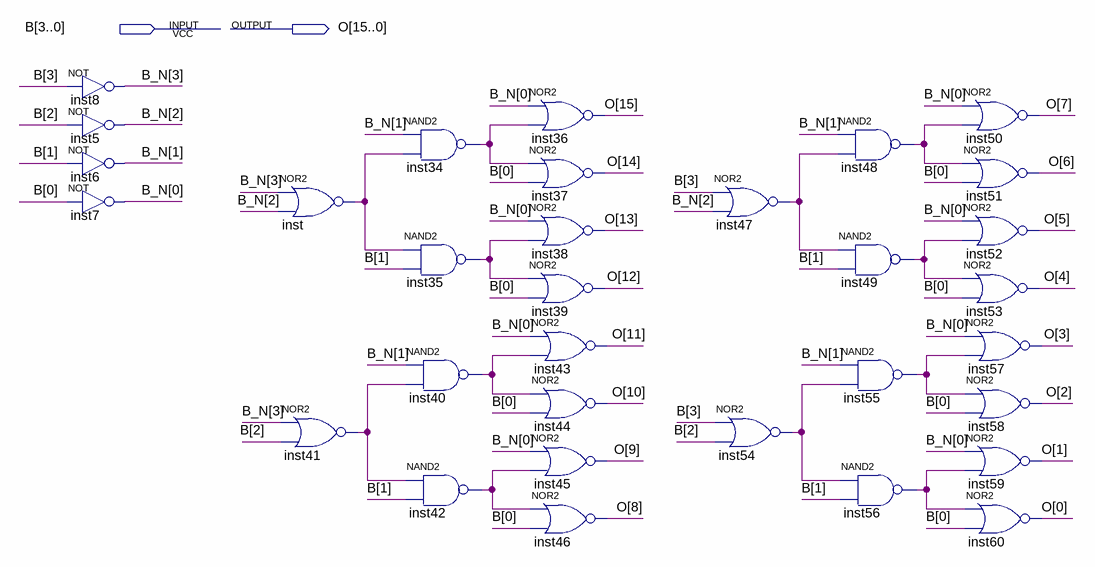
[diagram p0: schematic sheet]
// Quartus schematic DECODER_4BIT.bdf as structural Verilog: 32 symbols, 2 pins
module DECODER_4BIT (
  input  [3:0] B,
  output [15:0] O
);

  wire inst34_out, inst35_out, inst40_out, inst41_out, inst42_out, inst47_out, inst48_out, inst49_out,
       inst54_out, inst55_out, inst56_out, inst_out;
  wire [3:0] B_N;

  not inst8 (B_N[3], B[3]);
  not inst5 (B_N[2], B[2]);
  not inst6 (B_N[1], B[1]);
  not inst7 (B_N[0], B[0]);
  nor inst (inst_out, B_N[3], B_N[2]);
  nor inst41 (inst41_out, B_N[3], B[2]);
  nand inst34 (inst34_out, B_N[1], inst_out);
  nand inst35 (inst35_out, inst_out, B[1]);
  nand inst40 (inst40_out, B_N[1], inst41_out);
  nand inst42 (inst42_out, inst41_out, B[1]);
  nor inst36 (O[15], B_N[0], inst34_out);
  nor inst37 (O[14], inst34_out, B[0]);
  nor inst38 (O[13], B_N[0], inst35_out);
  nor inst39 (O[12], inst35_out, B[0]);
  nor inst43 (O[11], B_N[0], inst40_out);
  nor inst44 (O[10], inst40_out, B[0]);
  nor inst45 (O[9], B_N[0], inst42_out);
  nor inst46 (O[8], inst42_out, B[0]);
  nor inst47 (inst47_out, B[3], B_N[2]);
  nor inst54 (inst54_out, B[3], B[2]);
  nand inst48 (inst48_out, B_N[1], inst47_out);
  nand inst49 (inst49_out, inst47_out, B[1]);
  nand inst55 (inst55_out, B_N[1], inst54_out);
  nand inst56 (inst56_out, inst54_out, B[1]);
  nor inst50 (O[7], B_N[0], inst48_out);
  nor inst51 (O[6], inst48_out, B[0]);
  nor inst52 (O[5], B_N[0], inst49_out);
  nor inst53 (O[4], inst49_out, B[0]);
  nor inst57 (O[3], B_N[0], inst55_out);
  nor inst58 (O[2], inst55_out, B[0]);
  nor inst59 (O[1], B_N[0], inst56_out);
  nor inst60 (O[0], inst56_out, B[0]);
endmodule
